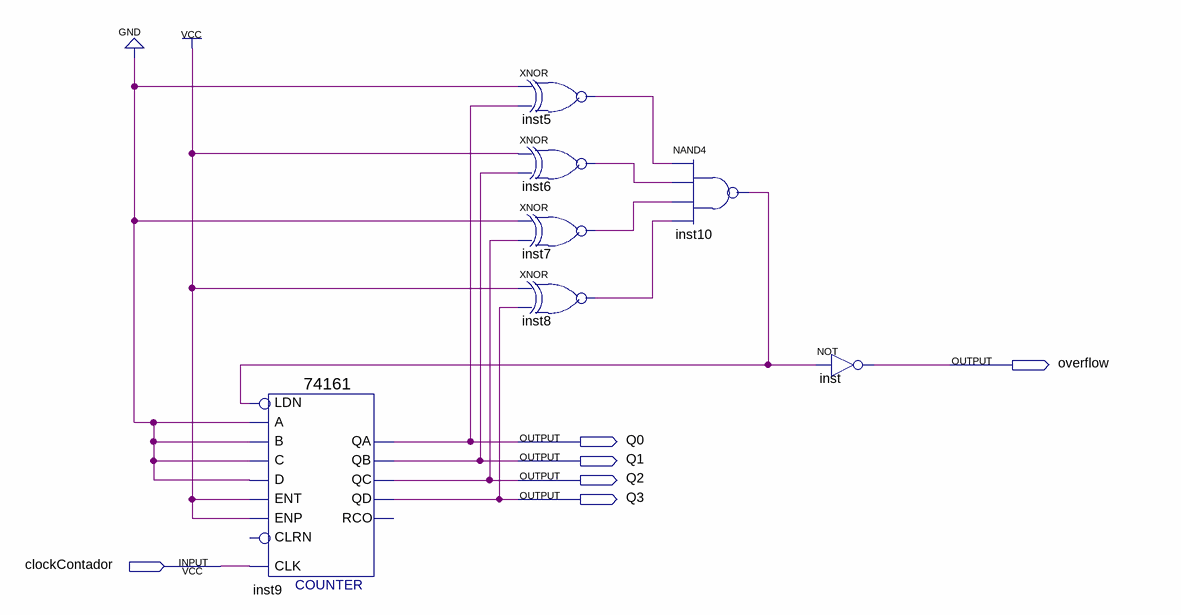
[diagram p0: schematic sheet]
// Quartus schematic Lab12c.bdf as structural Verilog: 7 symbols, 6 pins
module Lab12c (
  input  clockContador,
  output overflow,
  output Q0,
  output Q1,
  output Q2,
  output Q3
);

  wire inst5_out, inst6_out, inst7_out, inst8_out, inst10_out;

  \74161  inst9 (
    .CLK(clockContador), .ENP(1'b1), .LDN(inst10_out), .A(1'b0), .D(1'b0), .ENT(1'b1), .B(1'b0), .C(1'b0),
    .QD(Q3), .QC(Q2), .QB(Q1), .QA(Q0));  // open: CLRN, RCO
  xnor inst5 (inst5_out, 1'b0, Q0);
  xnor inst6 (inst6_out, 1'b1, Q1);
  xnor inst7 (inst7_out, 1'b0, Q2);
  xnor inst8 (inst8_out, 1'b1, Q3);
  nand inst10 (inst10_out, inst5_out, inst6_out, inst7_out, inst8_out);
  not inst (overflow, inst10_out);
endmodule
